# Altium schematic sheet eBox_Notes.SchDoc: eBox_Notes
size A4; DocumentNumber: 1; SheetNumber: 1; SheetTotal: 7
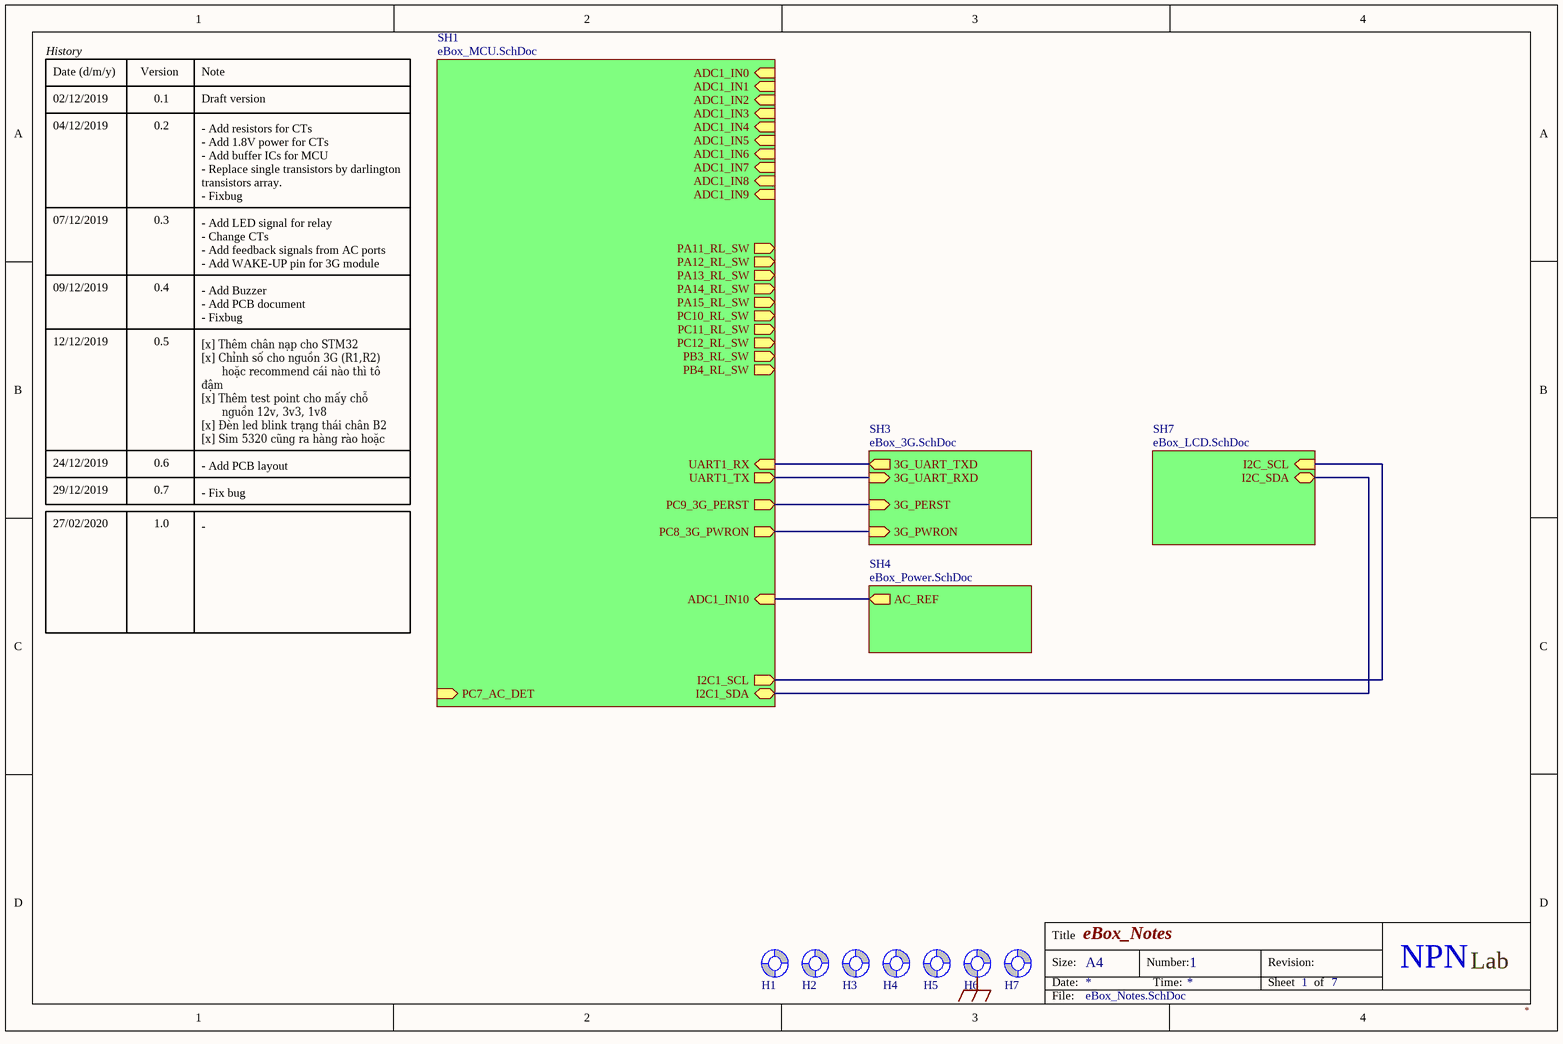
[diagram p0: eBox_Notes.SchDoc]

## Parts
H1  Screw Hole  [SCREW/3.2/7.0/M]  (value not drawn)  (no BOM)
H2  Screw Hole  [SCREW/3.2/7.0/M]  (value not drawn)  (no BOM)
H3  Screw Hole  [SCREW/3.2/7.0/M]  (value not drawn)  (no BOM)
H4  Screw Hole  [SCREW/3.2/7.0/M]  (value not drawn)  (no BOM)
H5  Screw Hole  [SCREW/3.2/7.0/M]  (value not drawn)  (no BOM)
H6  Screw Hole  [SCREW/3.2/7.0/M]  (value not drawn)  (no BOM)
H7  Screw Hole  [SCREW/3.2/7.0/M]  (value not drawn)  (no BOM)

## Sub-sheets
SH1 = eBox_MCU.SchDoc: PC8_3G_PWRON (out), PC9_3G_PERST (out), UART1_RX (in), UART1_TX (out), ADC1_IN0 (in), ADC1_IN1 (in), ADC1_IN2 (in), ADC1_IN3 (in), ADC1_IN4 (in), ADC1_IN5 (in), ADC1_IN6 (in), ADC1_IN9 (in), ADC1_IN7 (in), PA12_RL_SW (out), ADC1_IN8 (in), PA11_RL_SW (out), PA13_RL_SW (out), PA14_RL_SW (out), PA15_RL_SW (out), PC10_RL_SW (out), PC11_RL_SW (out), PB3_RL_SW (out), PB4_RL_SW (out), PC12_RL_SW (out), I2C1_SCL (out), I2C1_SDA (bidir), PC7_AC_DET (in), ADC1_IN10 (in)
SH3 = eBox_3G.SchDoc: 3G_UART_RXD (in), 3G_PERST (in), 3G_PWRON (in), 3G_UART_TXD (out)
SH4 = eBox_Power.SchDoc: AC_REF (out)
SH7 = eBox_LCD.SchDoc: I2C_SCL (in), I2C_SDA (bidir)

## Nets
GNDEARTH: H6.1(Screw)
(unnamed): sheet SH1/PC8_3G_PWRON, sheet SH3/3G_PWRON
(unnamed): sheet SH1/PC9_3G_PERST, sheet SH3/3G_PERST
(unnamed): sheet SH1/UART1_RX, sheet SH3/3G_UART_TXD
(unnamed): sheet SH1/UART1_TX, sheet SH3/3G_UART_RXD
(unnamed): sheet SH1/I2C1_SCL, sheet SH7/I2C_SCL
(unnamed): sheet SH1/I2C1_SDA, sheet SH7/I2C_SDA
(unnamed): sheet SH1/ADC1_IN10, sheet SH4/AC_REF

Not connected (* = marked no-connect by the designer): H1 1(Screw); H2 1(Screw); H3 1(Screw); H4 1(Screw); H5 1(Screw); H7 1(Screw)

## Notes on the sheet
- History
- Date (d/m/y)
- 02/12/2019
- Version
- 0.1
- Note
- Draft version
- 04/12/2019
- 0.2
- 07/12/2019
- 0.3
- - Add resistors for CTs
  - Add 1.8V power for CTs
  - Add buffer ICs for MCU
  - Replace single transistors by darlington  transistors array.
  - Fixbug
- 09/12/2019
- 0.4
- - Add LED signal for relay
  - Change CTs
  - Add feedback signals from AC ports
  - Add WAKE-UP pin for 3G module
- 12/12/2019
- 0.5
- - Add Buzzer
  - Add PCB document
  - Fixbug
- [x] Thêm chân nạp cho STM32
  [x] Chỉnh số cho nguồn 3G (R1,R2)
  hoặc recommend cái nào thì tô đậm
  [x] Thêm test point cho mấy chỗ
  nguồn 12v, 3v3, 1v8
  [x] Đèn led blink trạng thái chân B2
  [x] Sim 5320 cũng ra hàng rào hoặc
  test point uart để test
- 24/12/2019
- 29/12/2019
- 0.6
- 0.7
- - Add PCB layout
- - Fix bug
- 27/02/2020
- 1.0
- -
- Title
- Size:
- Date:
- A4
- Number:
- Time:
- Revision:
- Sheet
- of
- NPN
- Lab
- File:

## Library data of the parts
H1-H7 = Screw Hole: TYPE: NO-BOM; UNIT PRICE: 0